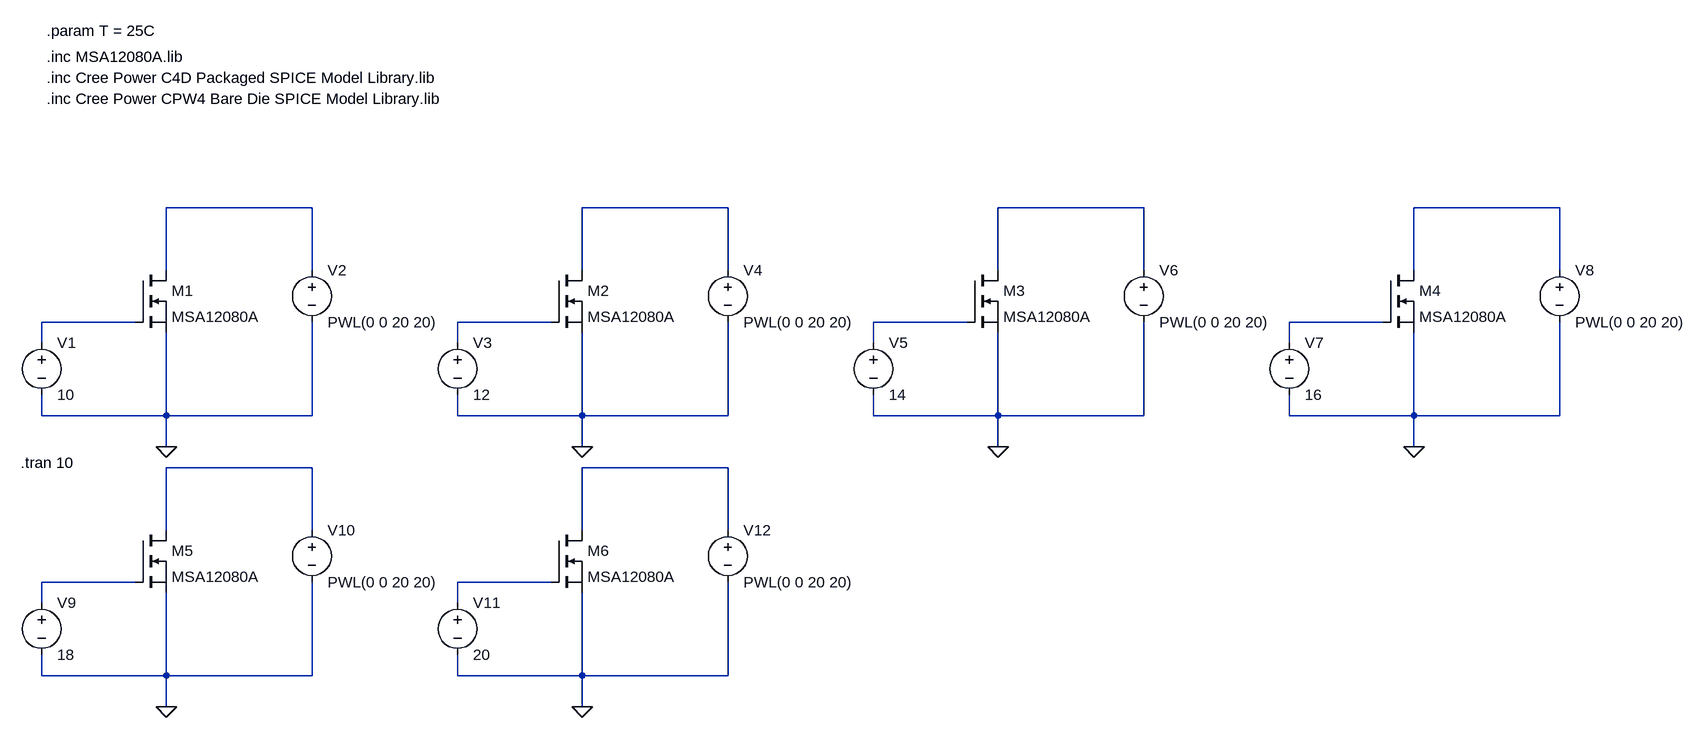
[diagram p0: schematic fwd_curves_3.asc]
fwd_curves_3.asc, the LTspice schematic file:
Version 4
SHEET 1 2916 1000
WIRE -304 -240 -528 -240
WIRE 336 -240 112 -240
WIRE 976 -240 752 -240
WIRE 1616 -240 1392 -240
WIRE -528 -144 -528 -240
WIRE -304 -144 -304 -240
WIRE 112 -144 112 -240
WIRE 336 -144 336 -240
WIRE 752 -144 752 -240
WIRE 976 -144 976 -240
WIRE 1392 -144 1392 -240
WIRE 1616 -144 1616 -240
WIRE -576 -64 -720 -64
WIRE 64 -64 -80 -64
WIRE 704 -64 560 -64
WIRE 1344 -64 1200 -64
WIRE -720 -32 -720 -64
WIRE -80 -32 -80 -64
WIRE 560 -32 560 -64
WIRE 1200 -32 1200 -64
WIRE -720 80 -720 48
WIRE -528 80 -528 -48
WIRE -528 80 -720 80
WIRE -304 80 -304 -64
WIRE -304 80 -528 80
WIRE -80 80 -80 48
WIRE 112 80 112 -48
WIRE 112 80 -80 80
WIRE 336 80 336 -64
WIRE 336 80 112 80
WIRE 560 80 560 48
WIRE 752 80 752 -48
WIRE 752 80 560 80
WIRE 976 80 976 -64
WIRE 976 80 752 80
WIRE 1200 80 1200 48
WIRE 1392 80 1392 -48
WIRE 1392 80 1200 80
WIRE 1616 80 1616 -64
WIRE 1616 80 1392 80
WIRE -528 128 -528 80
WIRE 112 128 112 80
WIRE 752 128 752 80
WIRE 1392 128 1392 80
WIRE -304 160 -528 160
WIRE 336 160 112 160
WIRE -528 256 -528 160
WIRE -304 256 -304 160
WIRE 112 256 112 160
WIRE 336 256 336 160
WIRE -576 336 -720 336
WIRE 64 336 -80 336
WIRE -720 368 -720 336
WIRE -80 368 -80 336
WIRE -720 480 -720 448
WIRE -528 480 -528 352
WIRE -528 480 -720 480
WIRE -304 480 -304 336
WIRE -304 480 -528 480
WIRE -80 480 -80 448
WIRE 112 480 112 352
WIRE 112 480 -80 480
WIRE 336 480 336 336
WIRE 336 480 112 480
WIRE -528 528 -528 480
WIRE 112 528 112 480
FLAG -528 128 0
FLAG 112 128 0
FLAG 752 128 0
FLAG 1392 128 0
FLAG -528 528 0
FLAG 112 528 0
SYMBOL nmos -576 -144 R0
SYMATTR InstName M1
SYMATTR Value MSA12080A
SYMATTR Prefix X
SYMBOL voltage -720 -48 R0
WINDOW 123 0 0 Left 0
WINDOW 39 0 0 Left 0
SYMATTR InstName V1
SYMATTR Value 10
SYMBOL voltage -304 -160 R0
WINDOW 123 0 0 Left 0
WINDOW 39 0 0 Left 0
SYMATTR InstName V2
SYMATTR Value PWL(0 0 20 20)
SYMBOL nmos 64 -144 R0
SYMATTR InstName M2
SYMATTR Value MSA12080A
SYMATTR Prefix X
SYMBOL voltage -80 -48 R0
WINDOW 123 0 0 Left 0
WINDOW 39 0 0 Left 0
SYMATTR InstName V3
SYMATTR Value 12
SYMBOL voltage 336 -160 R0
WINDOW 123 0 0 Left 0
WINDOW 39 0 0 Left 0
SYMATTR InstName V4
SYMATTR Value PWL(0 0 20 20)
SYMBOL nmos 704 -144 R0
SYMATTR InstName M3
SYMATTR Value MSA12080A
SYMATTR Prefix X
SYMBOL voltage 560 -48 R0
WINDOW 123 0 0 Left 0
WINDOW 39 0 0 Left 0
SYMATTR InstName V5
SYMATTR Value 14
SYMBOL voltage 976 -160 R0
WINDOW 123 0 0 Left 0
WINDOW 39 0 0 Left 0
SYMATTR InstName V6
SYMATTR Value PWL(0 0 20 20)
SYMBOL nmos 1344 -144 R0
SYMATTR InstName M4
SYMATTR Value MSA12080A
SYMATTR Prefix X
SYMBOL voltage 1200 -48 R0
WINDOW 123 0 0 Left 0
WINDOW 39 0 0 Left 0
SYMATTR InstName V7
SYMATTR Value 16
SYMBOL voltage 1616 -160 R0
WINDOW 123 0 0 Left 0
WINDOW 39 0 0 Left 0
SYMATTR InstName V8
SYMATTR Value PWL(0 0 20 20)
SYMBOL nmos -576 256 R0
SYMATTR InstName M5
SYMATTR Value MSA12080A
SYMATTR Prefix X
SYMBOL voltage -720 352 R0
WINDOW 123 0 0 Left 0
WINDOW 39 0 0 Left 0
SYMATTR InstName V9
SYMATTR Value 18
SYMBOL voltage -304 240 R0
WINDOW 123 0 0 Left 0
WINDOW 39 0 0 Left 0
SYMATTR InstName V10
SYMATTR Value PWL(0 0 20 20)
SYMBOL nmos 64 256 R0
SYMATTR InstName M6
SYMATTR Value MSA12080A
SYMATTR Prefix X
SYMBOL voltage -80 352 R0
WINDOW 123 0 0 Left 0
WINDOW 39 0 0 Left 0
SYMATTR InstName V11
SYMATTR Value 20
SYMBOL voltage 336 240 R0
WINDOW 123 0 0 Left 0
WINDOW 39 0 0 Left 0
SYMATTR InstName V12
SYMATTR Value PWL(0 0 20 20)
TEXT -752 152 Left 2 !.tran 10
TEXT -712 -472 Left 2 !.inc MSA12080A.lib
TEXT -712 -512 Left 2 !.param T = 25C
TEXT -712 -440 Left 2 !.inc Cree Power C4D Packaged SPICE Model Library.lib
TEXT -712 -408 Left 2 !.inc Cree Power CPW4 Bare Die SPICE Model Library.lib

The netlist it stands for:
* fwd_curves_3.asc
XM1 N001 N005 0 MSA12080A  ; pins D G S
V1 N005 0 10
V2 N001 0 PWL(0 0 20 20)
XM2 N002 N006 0 MSA12080A  ; pins D G S
V3 N006 0 12
V4 N002 0 PWL(0 0 20 20)
XM3 N003 N007 0 MSA12080A  ; pins D G S
V5 N007 0 14
V6 N003 0 PWL(0 0 20 20)
XM4 N004 N008 0 MSA12080A  ; pins D G S
V7 N008 0 16
V8 N004 0 PWL(0 0 20 20)
XM5 N009 N011 0 MSA12080A  ; pins D G S
V9 N011 0 18
V10 N009 0 PWL(0 0 20 20)
XM6 N010 N012 0 MSA12080A  ; pins D G S
V11 N012 0 20
V12 N010 0 PWL(0 0 20 20)
.tran 10
.inc MSA12080A.lib
.param T = 25C
.inc Cree Power C4D Packaged SPICE Model Library.lib
.inc Cree Power CPW4 Bare Die SPICE Model Library.lib
.backanno
.end